# EAGLE design MOSFET Board (EAGLE 6.5.0)
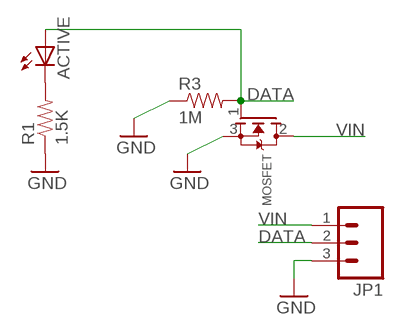
[diagram p0: schematic, sheet 1]

## Parts
ACTIVE  LED0603  [LED-0603]
JP1  M03POLAR  [MOLEX-1X3]
MOSFET  MOSFET-NGDS_TO220V  [TO220V]
R1  1.5K  RESISTOR1206  [1206]
R3  1M  RESISTOR1206  [1206]

## Nets
DATA: ACTIVE.A JP1.2 MOSFET.1(G) R3.2
GND: JP1.3 MOSFET.3(S) R1.1 R3.1
N$1: ACTIVE.C R1.2
VIN: JP1.1 MOSFET.2(D)

## Library data of the parts
ACTIVE = SparkFun-LED:LED: LEDs Standard schematic elements and footprints for 5mm, 3mm, 1206, and 0603 sized LEDs. 5mm - Spark Fun Electronics SKU : COM-00529 (and others)
JP1 = SparkFun-Connectors:M03: Header 3 Standard 3-pin 0.1" header. Use with straight break away headers (SKU : PRT-00116), right angle break away headers (PRT-00553), swiss pins (PRT-00743), machine pins (PRT-00117), and female headers (PRT-00115). Molex polarized connector foot print use with SKU : PRT-08232 with associated crimp pins and housings.
MOSFET = adafruit:MOSFET-N: N-Channel Mosfet 2N7002E - 60V 260mA SOT23 [Digikey: 2N7002ET1GOSTR-ND] - REEL BSH103 - 30V 850mA SOT23 [Digikey: 568-5013-1-ND]
R1 R3 = SparkFun-Passives:RESISTOR: Resistor Basic schematic elements and footprints for 0603, 1206, and PTH resistors.

## Board
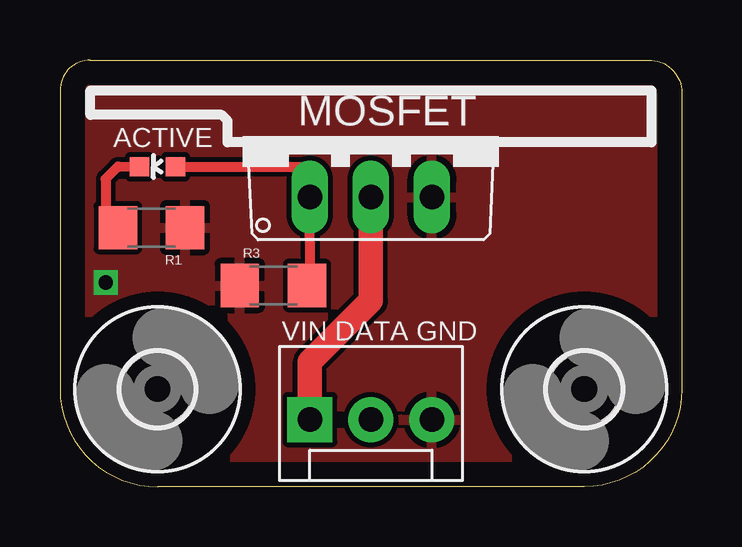
[diagram p1: board, top side]
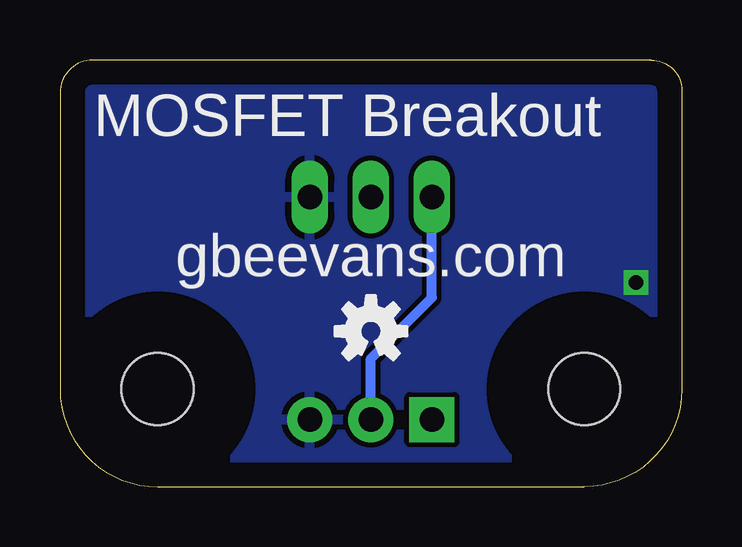
[diagram p2: board, bottom side, seen from below]

Size 25.91 x 17.78 mm. Coordinates in mm from the lower left corner, seen from the top.
Outline: 1.27,17.78 24.54,17.78 arc-90 25.91,16.41 25.91,4.06 arc-90 21.84,0 4.06,0 arc-90 0,4.06 0,16.51 arc-90 1.27,17.78
Copper layers (1*16): Top 0.035mm / dielectric 1.5mm / Bottom 0.035mm
Design rules "default": minimum track width 10mil, minimum drill 24mil, track to track 8mil, track to pad 8mil, pad to pad 8mil, via to via 8mil, smd to smd 8mil, copper to edge 40mil, drill to drill 8mil, minimum pad ring 10mil, minimum via ring 8mil, stop-mask expansion 4mil, vias tented up to drill 0mil, thermal gap 10mil

### Footprints (pad centres in the part's own frame; a part is rotated, then mirrored left to right if it is on the bottom)
LED-0603 = smd 0.8 x 0.8: A 0,-0.75; C 0,0.75
MOLEX-1X3 = drill 1.016 pad 1.88 square: 1 0,0 | drill 1.016 pad 1.88: 2 2.54,0; 3 5.08,0
TO220V = drill 1.016 long: 1 -2.54,-2.54; 2 0,-2.54; 3 2.54,-2.54
1206 = smd 1.6 x 1.8: 1 -1.4,0; 2 1.4,0
3,0 = hole 3: 0,0

### Placement (x,y rotation side)
ACTIVE  4.06,13.34 90 top
JP1  10.41,2.79 0 top
MOSFET  12.95,14.61 0 top
R1  3.81,10.79 180 top
R3  8.89,8.38 0 top
U$1  [3,0]  21.84,4.06 0 top
U$2  [3,0]  4.06,4.06 0 top
U$3  [OSHW-LOGO-S]  12.95,6.48 0 bottom

### Tracks (layer width: path | path; a pad name or v marks a point on that pad's centre or on a via)
DATA
  Top 0.406: R3.2 10.42,8.38 MOSFET.1 10.41,13.21 10.29,13.34 ACTIVE.A
  Bottom 0.406: JP1.2 12.95,5.33 10.41,7.87 MOSFET.1
GND  (via drill 0.6)
  other vias: 1.91,8.51
  pour Top: 0,17.78 0,0 25.91,0 25.91,17.78
  pour Bottom: 0,17.78 25.91,17.78 25.91,0 0,0
N$1
  Top 0.406: ACTIVE.C 2.39,13.31 2.41,13.34 1.91,12.83 1.91,11.3 R1.2
VIN
  Top 1.016: JP1.1 10.41,5.21 12.95,7.75 MOSFET.2

### Text on the board
tPlace: VIN DATA GND
bPlace: MOSFET Breakout | gbeevans.com